# Altium schematic sheet playB.SchDoc
size A4
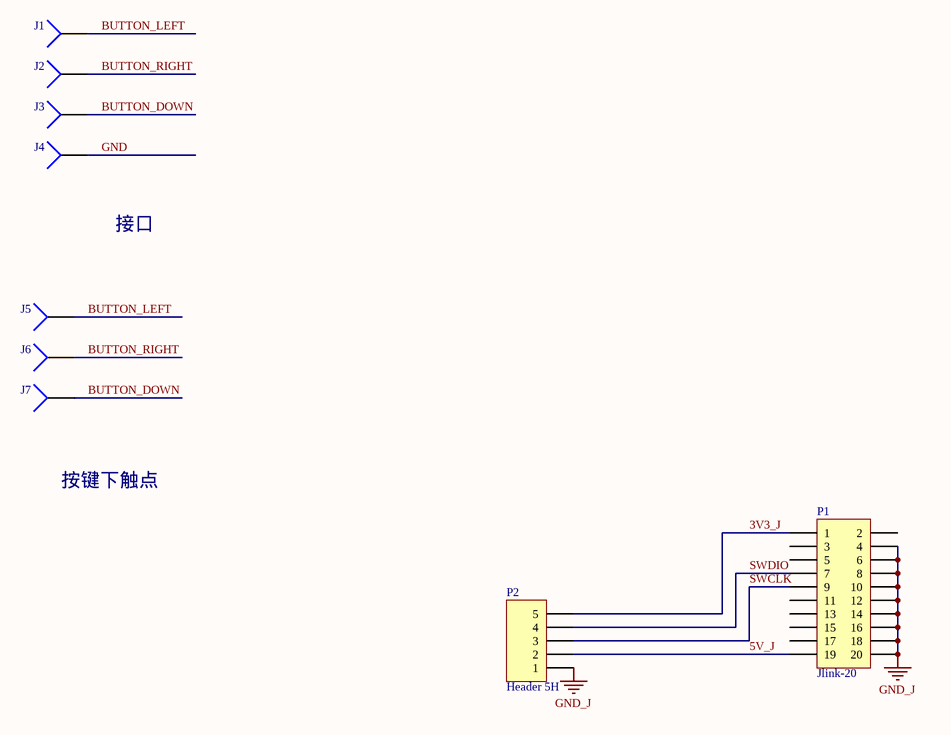
[diagram p0: playB.SchDoc]

## Parts
J1  PAD  [LINK_HOLE]  (value not drawn)
J2  PAD  [LINK_HOLE]  (value not drawn)
J3  PAD  [LINK_HOLE]  (value not drawn)
J4  PAD  [LINK_HOLE]  (value not drawn)
J5  PAD  [Button_Pad]  (value not drawn)
J6  PAD  [Button_Pad]  (value not drawn)
J7  PAD  [Button_Pad]  (value not drawn)
P1  Jlink-20  [J-LINK]
P2  Header 5H  [connect_5pin]

## Nets
GND_J: P1.4 P1.6 P1.8 P1.10 P1.12 P1.14 P1.16 P1.18 P1.20 P2.1
3V3_J: P1.1 P2.5
5V_J: P1.19 P2.2
BUTTON_DOWN: J3.1 J7.1
BUTTON_LEFT: J1.1 J5.1
BUTTON_RIGHT: J2.1 J6.1
GND: J4.1
SWCLK: P1.9 P2.3
SWDIO: P1.7 P2.4

Not connected (* = marked no-connect by the designer): P1 2 3 5 11 13 15 17

## Notes on the sheet
- 接口
- 按键下触点

## Library data of the parts
J1-J7 = Socket: LatestRevisionDate: 17-Jul-2002; LatestRevisionNote: Re-released for DXP Platform.; Publisher: Altium Limited
P1 = Header 10X2: Header, 10-Pin, Dual row; LatestRevisionDate: 17-Jul-2002; LatestRevisionNote: Re-released for DXP Platform.; Publisher: Altium Limited
P2 = Header 5H: Header, 5-Pin, Right Angle; LatestRevisionDate: 17-Jul-2002; LatestRevisionNote: Re-released for DXP Platform.; Publisher: Altium Limited